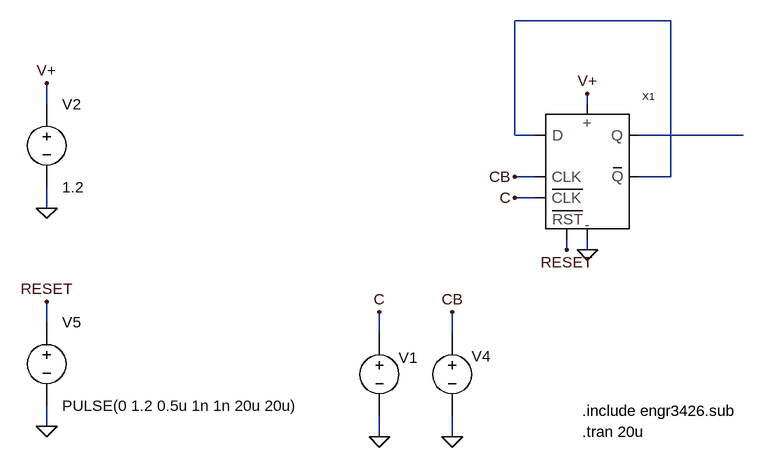
[diagram p0: schematic OneBitCounter_DFF.asc]
OneBitCounter_DFF.asc, the LTspice schematic file:
Version 4
SHEET 1 880 788
WIRE 352 -64 112 -64
WIRE -608 64 -608 32
WIRE 224 64 224 48
WIRE 112 112 112 -64
WIRE 144 112 112 112
WIRE 464 112 304 112
WIRE 144 176 112 176
WIRE 352 176 352 -64
WIRE 352 176 304 176
WIRE 144 208 112 208
WIRE -608 224 -608 192
WIRE 192 288 192 272
WIRE 224 288 224 272
WIRE -608 400 -608 368
WIRE -96 416 -96 384
WIRE 16 416 16 384
WIRE -608 560 -608 528
WIRE -96 576 -96 544
WIRE 16 576 16 544
FLAG 224 48 V+
FLAG -96 576 0
FLAG -608 224 0
FLAG -608 32 V+
FLAG 112 176 CB
FLAG 112 208 C
FLAG -96 384 C
FLAG 192 288 RESET
FLAG 224 288 0
FLAG 16 576 0
FLAG 16 384 CB
FLAG -608 560 0
FLAG -608 368 RESET
SYMBOL FlipFlop 224 176 R0
SYMATTR InstName X1
SYMATTR SpiceLine nmosL=0.9u nmosW=1.8u pmosL=0.9u pmosW=3.6u
SYMBOL cktsym\\vsource -96 480 R0
WINDOW 3 48 16 Invisible 2
WINDOW 0 30 -26 Left 2
WINDOW 123 0 0 Left 2
WINDOW 39 0 0 Left 2
SYMATTR Value PULSE(0 1.2 1n 1n 1n 2u 4u)
SYMATTR InstName V1
SYMBOL cktsym\\vsource -608 128 R0
WINDOW 123 0 0 Left 2
WINDOW 39 0 0 Left 2
SYMATTR Value 1.2
SYMATTR InstName V2
SYMBOL cktsym\\vsource 16 480 R0
WINDOW 3 48 16 Invisible 2
WINDOW 0 30 -28 Left 2
WINDOW 123 0 0 Left 2
WINDOW 39 0 0 Left 2
SYMATTR Value PULSE(1.2 0 1n 1n 1n 2u 4u)
SYMATTR InstName V4
SYMBOL cktsym\\vsource -608 464 R0
WINDOW 123 0 0 Left 2
WINDOW 39 0 0 Left 2
SYMATTR Value PULSE(0 1.2 0.5u 1n 1n 20u 20u)
SYMATTR InstName V5
TEXT 216 568 Left 2 !.tran 20u
TEXT 216 536 Left 2 !.include engr3426.sub

The netlist it stands for:
* OneBitCounter_DFF.asc
XX1 N001 CB C N002 N001 RESET V+ 0 FlipFlop nmosL=0.9u nmosW=1.8u pmosL=0.9u pmosW=3.6u  ; pins D CLK CLKb Q Qb RESETb pos neg
V1 C 0 PULSE(0 1.2 1n 1n 1n 2u 4u)
V2 V+ 0 1.2
V4 CB 0 PULSE(1.2 0 1n 1n 1n 2u 4u)
V5 RESET 0 PULSE(0 1.2 0.5u 1n 1n 20u 20u)
.tran 20u
.include engr3426.sub
.backanno
.end